# EAGLE design FM-1.2 (EAGLE 8.2.1)
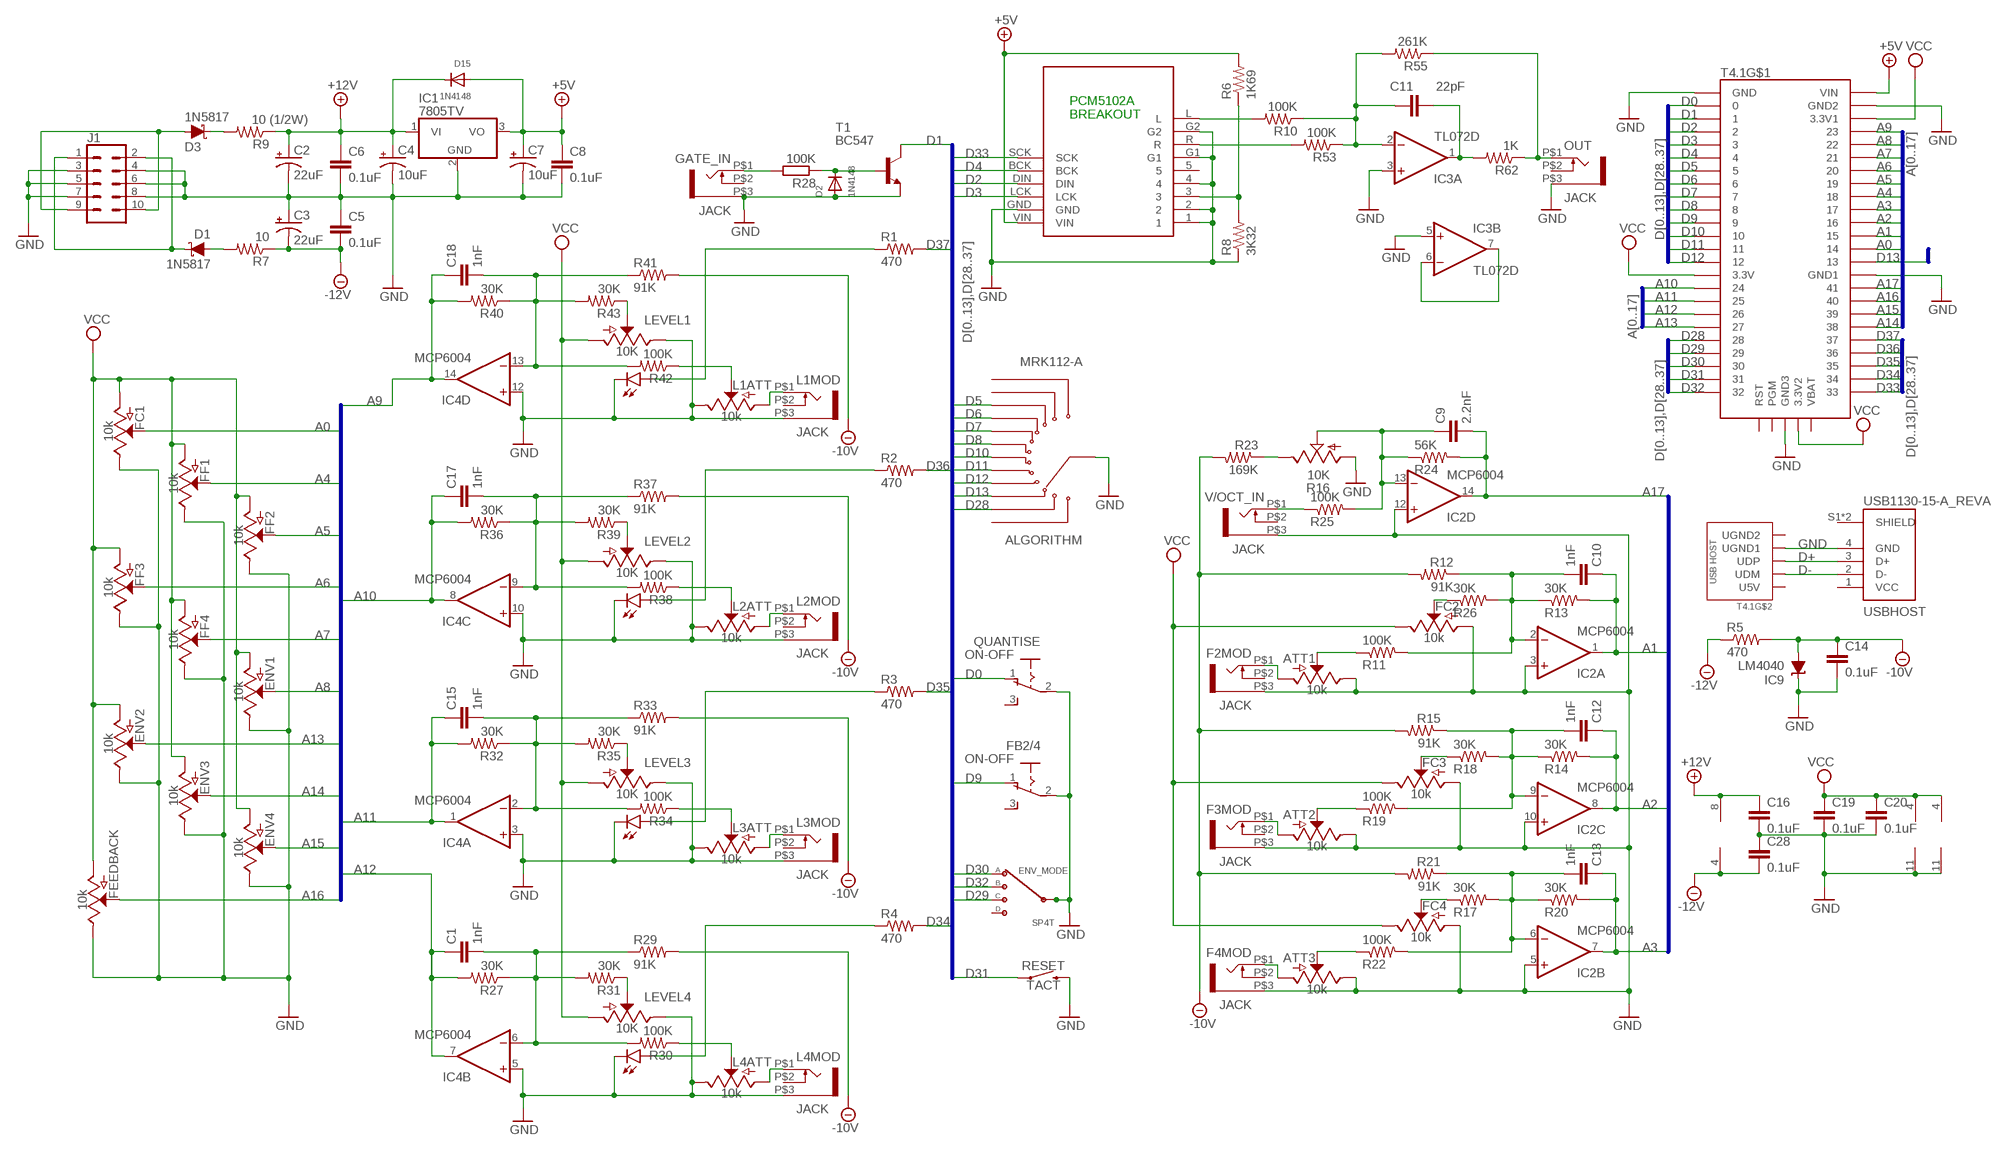
[diagram p0: schematic, sheet 1]

## Parts
ALGORITHM  MRK112-A  [SW_MRK112-A]
ATT1  10k  POTENTIOMETER-PTH-9MM-1/20W-20%  [POT-PTH-ALPS]
ATT2  10k  POTENTIOMETER-PTH-9MM-1/20W-20%  [POT-PTH-ALPS]
ATT3  10k  POTENTIOMETER-PTH-9MM-1/20W-20%  [POT-PTH-ALPS]
C1  1nF  C-EUC0603K  [C0603K]
C2  22uF  10UF-POLAR-RADIAL-2.5MM-25V-20%  [CPOL-RADIAL-2.5MM-5MM]
C3  22uF  10UF-POLAR-RADIAL-2.5MM-25V-20%  [CPOL-RADIAL-2.5MM-5MM]
C4  10uF  10UF-POLAR-RADIAL-2.5MM-25V-20%  [CPOL-RADIAL-2.5MM-5MM]
C5  0.1uF  C-EUC0603K  [C0603K]
C6  0.1uF  C-EUC0603K  [C0603K]
C7  10uF  10UF-POLAR-RADIAL-2.5MM-25V-20%  [CPOL-RADIAL-2.5MM-5MM]
C8  0.1uF  C-EUC0603K  [C0603K]
C9  2.2nF  C-EUC0603K  [C0603K]
C10  1nF  C-EUC0603K  [C0603K]
C11  22pF  C-EUC0603K  [C0603K]
C12  1nF  C-EUC0603K  [C0603K]
C13  1nF  C-EUC0603K  [C0603K]
C14  0.1uF  C-EUC0603K  [C0603K]
C15  1nF  C-EUC0603K  [C0603K]
C16  0.1uF  C-EUC0603K  [C0603K]
C17  1nF  C-EUC0603K  [C0603K]
C18  1nF  C-EUC0603K  [C0603K]
C19  0.1uF  C-EUC0603K  [C0603K]
C20  0.1uF  C-EUC0603K  [C0603K]
C28  0.1uF  C-EUC0603K  [C0603K]
D1  1N5817  DIODE-SCHOTTKY-BAT60A  [SOD-323]
D2  1N4148  DIODESOD-123  [SOD-123]
D3  1N5817  DIODE-SCHOTTKY-BAT60A  [SOD-323]
D15  1N4148  DIODESOD-123  [SOD-123]
ENV1  10k  POTENTIOMETER-PTH-9MM-1/20W-20%  [POT-PTH-ALPS]
ENV2  10k  POTENTIOMETER-PTH-9MM-1/20W-20%  [POT-PTH-ALPS]
ENV3  10k  POTENTIOMETER-PTH-9MM-1/20W-20%  [POT-PTH-ALPS]
ENV4  10k  POTENTIOMETER-PTH-9MM-1/20W-20%  [POT-PTH-ALPS]
ENV_MODE  SP4T  [SP4T]
F2MOD  JACK  WQP-PJ301M-12_JACK  [WQP-PJ301M-12_JACK]
F3MOD  JACK  WQP-PJ301M-12_JACK  [WQP-PJ301M-12_JACK]
F4MOD  JACK  WQP-PJ301M-12_JACK  [WQP-PJ301M-12_JACK]
FB2/4  ON-OFF  255SB  [255SB]
FC1  10k  POTENTIOMETER-PTH-9MM-1/20W-20%  [POT-PTH-ALPS]
FC2  10k  POTENTIOMETER-PTH-9MM-1/20W-20%  [POT-PTH-ALPS]
FC3  10k  POTENTIOMETER-PTH-9MM-1/20W-20%  [POT-PTH-ALPS]
FC4  10k  POTENTIOMETER-PTH-9MM-1/20W-20%  [POT-PTH-ALPS]
FEEDBACK  10k  POTENTIOMETER-PTH-9MM-1/20W-20%  [POT-PTH-ALPS]
FF1  10k  POTENTIOMETER-PTH-9MM-1/20W-20%  [POT-PTH-ALPS]
FF2  10k  POTENTIOMETER-PTH-9MM-1/20W-20%  [POT-PTH-ALPS]
FF3  10k  POTENTIOMETER-PTH-9MM-1/20W-20%  [POT-PTH-ALPS]
FF4  10k  POTENTIOMETER-PTH-9MM-1/20W-20%  [POT-PTH-ALPS]
GATE_IN  JACK  WQP-PJ301M-12_JACK  [WQP-PJ301M-12_JACK]
IC1  7805TV  [TO220V]
IC2  MCP6004  4AMP_P4+11D  [SO14]
IC3  TL072D  [SO08]
IC4  MCP6004  4AMP_P4+11D  [SO14]
IC9  LM4040  LM4041A12LP  [LP_O-PBCY-W3]
J1  CONN_05X2SHD  [2X5-SHROUDED]
L1ATT  10k  POTENTIOMETER-PTH-9MM-1/20W-20%  [POT-PTH-ALPS]
L1MOD  JACK  WQP-PJ301M-12_JACK  [WQP-PJ301M-12_JACK]
L2ATT  10k  POTENTIOMETER-PTH-9MM-1/20W-20%  [POT-PTH-ALPS]
L2MOD  JACK  WQP-PJ301M-12_JACK  [WQP-PJ301M-12_JACK]
L3ATT  10k  POTENTIOMETER-PTH-9MM-1/20W-20%  [POT-PTH-ALPS]
L3MOD  JACK  WQP-PJ301M-12_JACK  [WQP-PJ301M-12_JACK]
L4ATT  10k  POTENTIOMETER-PTH-9MM-1/20W-20%  [POT-PTH-ALPS]
L4MOD  JACK  WQP-PJ301M-12_JACK  [WQP-PJ301M-12_JACK]
LEVEL1  10K  POTENTIOMETER_SLIDE_LEDMEDIUM  [SLIDER-MEDIUM-LED]
LEVEL2  10K  POTENTIOMETER_SLIDE_LEDMEDIUM  [SLIDER-MEDIUM-LED]
LEVEL3  10K  POTENTIOMETER_SLIDE_LEDMEDIUM  [SLIDER-MEDIUM-LED]
LEVEL4  10K  POTENTIOMETER_SLIDE_LEDMEDIUM  [SLIDER-MEDIUM-LED]
OUT  JACK  WQP-PJ301M-12_JACK  [WQP-PJ301M-12_JACK]
QUANTISE  ON-OFF  255SB  [255SB]
R1  470  R-US_R0603  [R0603]
R2  470  R-US_R0603  [R0603]
R3  470  R-US_R0603  [R0603]
R4  470  R-US_R0603  [R0603]
R5  470  R-US_R0603  [R0603]
R6  1K69  R-US_R0603  [R0603]
R7  10  R-US_R0603  [R0603]
R8  3K32  R-US_R0603  [R0603]
R9  10 (1/2W)  R-US_0207/10  [0207/10]
R10  100K  R-US_R0603  [R0603]
R11  100K  R-US_R0603  [R0603]
R12  91K  R-US_R0603  [R0603]
R13  30K  R-US_R0603  [R0603]
R14  30K  R-US_R0603  [R0603]
R15  91K  R-US_R0603  [R0603]
R16  10K  TRIM_US-B25P  [B25P]
R17  30K  R-US_R0603  [R0603]
R18  30K  R-US_R0603  [R0603]
R19  100K  R-US_R0603  [R0603]
R20  30K  R-US_R0603  [R0603]
R21  91K  R-US_R0603  [R0603]
R22  100K  R-US_R0603  [R0603]
R23  169K  R-US_R0603  [R0603]
R24  56K  R-US_R0603  [R0603]
R25  100K  R-US_R0603  [R0603]
R26  30K  R-US_R0603  [R0603]
R27  30K  R-US_R0603  [R0603]
R28  100K  R-EU_R0603  [R0603]
R29  91K  R-US_R0603  [R0603]
R30  100K  R-US_R0603  [R0603]
R31  30K  R-US_R0603  [R0603]
R32  30K  R-US_R0603  [R0603]
R33  91K  R-US_R0603  [R0603]
R34  100K  R-US_R0603  [R0603]
R35  30K  R-US_R0603  [R0603]
R36  30K  R-US_R0603  [R0603]
R37  91K  R-US_R0603  [R0603]
R38  100K  R-US_R0603  [R0603]
R39  30K  R-US_R0603  [R0603]
R40  30K  R-US_R0603  [R0603]
R41  91K  R-US_R0603  [R0603]
R42  100K  R-US_R0603  [R0603]
R43  30K  R-US_R0603  [R0603]
R53  100K  R-US_R0603  [R0603]
R55  261K  R-US_R0603  [R0603]
R62  1K  R-US_R0603  [R0603]
RESET  TACT  MOMENTARY-SWITCH-SPST-PTH-6.0MM  [TACTILE_SWITCH_PTH_6.0MM]
T1  BC547  [TO92]
T4.1  TEENSY4.1  [TEENSY4.1]
U$2  PCM5102A BREAKOUT  I2S_PCM_51XX_SOUNDCARD  [I2S_PCM_5100_SOUNDCARD]
USBHOST  USB1130-15-A_REVA  [GCT_USB1130-15-A_REVA]
V/OCT_IN  JACK  WQP-PJ301M-12_JACK  [WQP-PJ301M-12_JACK]

## Nets
+5V: C7.1(+) C8.1 D15.A IC1.3(VO) R6.2 T4.1.VIN U$2.VIN
+12V: C2.1(+) C4.1(+) C6.1 C16.1 D15.C IC1.1(VI) IC3.8(P:V+) R9.1
-10V: C14.1 IC9.3(A) R5.2 R12.2 R15.2 R21.2 R23.2 R29.2 R33.2 R37.2 R41.2
-12V: C3.2(-) C5.2 C28.2 IC3.4(P:V-) R5.1 R7.1
A0: FC1.P$2(S) T4.1.14/A0
A1: C10.1 IC2.1(A:OUT) R13.2 T4.1.15/A1
A2: C12.1 IC2.8(C:OUT) R14.2 T4.1.16/A2
A3: C13.1 IC2.7(B:OUT) R20.2 T4.1.17/A3
A4: FF1.P$2(S) T4.1.18/A4/SDA
A5: FF2.P$2(S) T4.1.19/A5/SCL
A6: FF3.P$2(S) T4.1.20/A6
A7: FF4.P$2(S) T4.1.21/A7
A8: ENV1.P$2(S) T4.1.22/A8
A9: C18.1 IC4.14(D:OUT) R40.2 T4.1.23/A9
A10: C17.1 IC4.8(C:OUT) R36.2 T4.1.24
A11: C15.1 IC4.1(A:OUT) R32.2 T4.1.25
A12: C1.1 IC4.7(B:OUT) R27.2 T4.1.26
A13: ENV2.P$2(S) T4.1.27
A14: ENV3.P$2(S) T4.1.38
A15: ENV4.P$2(S) T4.1.39
A16: FEEDBACK.P$2(S) T4.1.40
A17: C9.2 IC2.14(D:OUT) R24.2 T4.1.41
D0: QUANTISE.1(O) T4.1.0/RX
D1: T1.3(C) T4.1.1/TX
D2: T4.1.2 U$2.DIN
D3: T4.1.3 U$2.LCK
D4: T4.1.4 U$2.BCK
D5: ALGORITHM.10 T4.1.5
D6: ALGORITHM.9 T4.1.6
D7: ALGORITHM.8 T4.1.7
D8: ALGORITHM.7 T4.1.8
D9: FB2/4.1(O) T4.1.9
D10: ALGORITHM.6 T4.1.10/CS
D11: ALGORITHM.5 T4.1.11/MOSI
D12: ALGORITHM.4 T4.1.12/MISO
D13: ALGORITHM.3 T4.1.13/SCK
D28: ALGORITHM.2 T4.1.28
D29: ENV_MODE.4(C) T4.1.29
D30: ENV_MODE.2(A) T4.1.30
D31: RESET.1 T4.1.31/A12
D32: ENV_MODE.3(B) T4.1.32
D33: T4.1.33 U$2.SCK
D34: R4.2 T4.1.34
D35: R3.2 T4.1.35
D36: R2.2 T4.1.36
D37: R1.2 T4.1.37
D+: T4.1.UD+(UDP) USBHOST.3(D+)
D-: T4.1.UD-(UDM) USBHOST.2(D-)
GND: ALGORITHM.A ATT1.P$1(E) ATT2.P$1(E) ATT3.P$1(E) C2.2(-) C3.1(+) C4.2(-) C5.1 C6.2 C7.2(-) C8.2 C14.2 C16.2 C19.2 C20.2 C28.1 D2.A ENV1.P$1(E) ENV2.P$1(E) ENV3.P$1(E) ENV4.P$1(E) ENV_MODE.1(INPUT) ENV_MODE.6 F2MOD.P$3 F3MOD.P$3 F4MOD.P$3 FB2/4.2(P) FC1.P$1(E) FC2.P$3(A) FC3.P$3(A) FC4.P$3(A) FEEDBACK.P$1(E) FF1.P$1(E) FF2.P$1(E) FF3.P$1(E) FF4.P$1(E) GATE_IN.P$3 IC1.2(GND) IC2.3(A:+IN) IC2.5(B:+IN) IC2.10(C:+IN) IC2.11(P:V-) IC2.12(D:+IN) IC3.3(A:+IN) IC3.5(B:+IN) IC4.3(A:+IN) IC4.5(B:+IN) IC4.10(C:+IN) IC4.11(P:V-) IC4.12(D:+IN) IC9.2(C) J1.3 J1.4 J1.5 J1.6 J1.7 J1.8 L1ATT.P$1(E) L1MOD.P$3 L2ATT.P$1(E) L2MOD.P$3 L3ATT.P$1(E) L3MOD.P$3 L4ATT.P$1(E) L4MOD.P$3 LEVEL1.P$3 LEVEL1.P$E(E) LEVEL2.P$3 LEVEL2.P$E(E) LEVEL3.P$3 LEVEL3.P$E(E) LEVEL4.P$3 LEVEL4.P$E(E) OUT.P$3 QUANTISE.2(P) R8.1 R16.A RESET.3 T1.1(E) T4.1.AGND(GND2) T4.1.GND T4.1.GND1 T4.1.GND2(GND3) T4.1.GND-U1(UGND1) U$2.1 U$2.2 U$2.4 U$2.G1 U$2.G2 U$2.GND USBHOST.4(GND) V/OCT_IN.P$3
N$1: C11.2 IC3.1(A:OUT) R62.2
N$2: LEVEL3.P$B(B) R3.1
N$3: C15.2 IC4.2(A:-IN) R32.1 R33.1 R34.2 R35.2
N$4: D1.C J1.1 J1.2
N$5: R25.1 V/OCT_IN.P$1
N$6: D3.A J1.9 J1.10
N$7: D3.C R9.2
N$8: LEVEL3.P$2 R35.1
N$9: D1.A R7.2
N$10: LEVEL4.P$B(B) R4.1
N$11: R10.2 U$2.L
N$12: R6.1 R8.2 U$2.3
N$13: R53.2 U$2.R
N$14: ATT2.P$3(A) F3MOD.P$1
N$15: FC2.P$2(S) R26.1
N$16: C10.2 IC2.2(A:-IN) R11.2 R12.1 R13.1 R26.2
N$17: C12.2 IC2.9(C:-IN) R14.1 R15.1 R18.2 R19.2
N$18: ATT1.P$2(S) R11.1
N$19: C13.2 IC2.6(B:-IN) R17.2 R20.1 R21.1 R22.2
N$20: ATT2.P$2(S) R19.1
N$21: C9.1 IC2.13(D:-IN) R16.S R24.1 R25.2
N$22: FC4.P$2(S) R17.1
N$23: ATT3.P$3(A) F4MOD.P$1
N$24: FC3.P$2(S) R18.1
N$25: R16.E R23.1
N$26: IC3.6(B:-IN) IC3.7(B:OUT)
N$27: ATT3.P$2(S) R22.1
N$28: ATT1.P$3(A) F2MOD.P$1
N$29: GATE_IN.P$1 R28.2
N$30: D2.C R28.1 T1.2(B)
N$31: C1.2 IC4.6(B:-IN) R27.1 R29.1 R30.2 R31.2
N$32: LEVEL4.P$2 R31.1
N$33: L4ATT.P$3(A) L4MOD.P$1
N$34: L4ATT.P$2(S) R30.1
N$36: L3ATT.P$3(A) L3MOD.P$1
N$37: L3ATT.P$2(S) R34.1
N$39: LEVEL2.P$B(B) R2.1
N$40: C17.2 IC4.9(C:-IN) R36.1 R37.1 R38.2 R39.2
N$41: LEVEL2.P$2 R39.1
N$42: L2ATT.P$3(A) L2MOD.P$1
N$43: L2ATT.P$2(S) R38.1
N$45: LEVEL1.P$B(B) R1.1
N$46: C18.2 IC4.13(D:-IN) R40.1 R41.1 R42.2 R43.2
N$47: LEVEL1.P$2 R43.1
N$48: L1ATT.P$3(A) L1MOD.P$1
N$49: L1ATT.P$2(S) R42.1
N$53: C11.1 IC3.2(A:-IN) R10.1 R53.1 R55.2
N$55: OUT.P$1 R55.1 R62.1
VCC: C19.1 C20.1 ENV1.P$3(A) ENV2.P$3(A) ENV3.P$3(A) ENV4.P$3(A) FC1.P$3(A) FC2.P$1(E) FC3.P$1(E) FC4.P$1(E) FEEDBACK.P$3(A) FF1.P$3(A) FF2.P$3(A) FF3.P$3(A) FF4.P$3(A) IC2.4(P:V+) IC4.4(P:V+) LEVEL1.P$1 LEVEL2.P$1 LEVEL3.P$1 LEVEL4.P$1 T4.1.3V3(3.3V) T4.1.3V3_LO(3.3V1) T4.1.V33(3.3V2)
Unconnected: ALGORITHM.1 ALGORITHM.11 ALGORITHM.12 ENV_MODE.5(D) F2MOD.P$2 F3MOD.P$2 F4MOD.P$2 FB2/4.3(S) GATE_IN.P$2 L1MOD.P$2 L2MOD.P$2 L3MOD.P$2 L4MOD.P$2 OUT.P$2 QUANTISE.3(S) T4.1.ELED T4.1.ER+ T4.1.ER- T4.1.ET+(ET-) T4.1.ET-(ET+) T4.1.GND-E(EGND) T4.1.GND-U2(UGND2) T4.1.PROG(PGM) T4.1.RST T4.1.UVHST(U5V) T4.1.VBAT U$2.5 USBHOST.S1(SHIELD) USBHOST.S2(SHIELD) V/OCT_IN.P$2

## Buses
A[0..17]
D[0..13],D[28..37]

## Notes on the sheet
- PCM5102A
  BREAKOUT

## Power pins joined to a net without a drawn wire
VCC: USBHOST.1(VCC)

## Library data of the parts
ALGORITHM = MRK112-A:MRK112-A: Check availability <https://pricing.snapeda.com/parts/MRK112-A/NKK%20Switches/view-part?ref=eda>; AVAILABILITY: In Stock; DESCRIPTION: Rotary Switch 2 ~ 12 Position SP12T 0.4VA (AC/DC) 28 VAC Panel Mount, Through Hole; MF: NKK Switches; MP: MRK112-A; PACKAGE: None; PRICE: None; PURCHASE-URL: https://pricing.snapeda.com/search/part/MRK112-A/?ref=eda
ATT1-ATT3 ENV1-ENV4 FC1-FC4 FEEDBACK FF1-FF4 L1ATT L2ATT L3ATT L4ATT = SparkFun-Resistors:POTENTIOMETER: Potentiometer (Pot) Three-terminal potentiometers, with an adjustable wiper and two adjustable resistors. A pot can be used to create a configurable voltage divider, or as a variable resistor. Variants ALPS_POT and ALPS_POT_KIT - PTH, breadboard compatible, 9mm square pots Rotary Potentiometer - Linear (10k ohm) <https://www.sparkfun.com/products/9288> (COM-09288) The KIT variant exposes copper on only one side of the PTH pad, so the part can only be assembled on one side of the PCB. Useful for beginner soldering kits.; PROD_ID: RES-09177; SF_SKU: COM-09288
C1 C5 C6 C8-C20 C28 = rcl:C-EU: CAPACITOR, European symbol
C2 C3 = SparkFun-Capacitors:10UF-POLAR: 10.0µF polarized capacitors A capacitor is a passive two-terminal electrical component used to store electrical energy temporarily in an electric field.; PROD_ID: CAP-08440; VALUE: 10uF
C4 C7 = SparkFun-Capacitors:10UF-POLAR: 10.0µF polarized capacitors A capacitor is a passive two-terminal electrical component used to store electrical energy temporarily in an electric field.; PROD_ID: CAP-08440
D1 D3 = SparkFun-DiscreteSemi:DIODE-SCHOTTKY: Schottky diode A Schottky diode is a semiconductor diode which has a low forward voltage drop and a very fast switching action.; PROD_ID: DIO-14072; VALUE: 3A/10V/280mV
D2 D15 = adafruit:DIODE: Diode SMADIODE - SMA Surface Mount Package 20V 1A Schottky Diode Digikey: 641-1014-6-ND DO-1N4148 - Through Hole Small Current Diode SOD-123 20V 1 A (.5mV Vf) Schottky Diode - Digikey: MBRX120TPMSCT-ND SOD-323 10V 570mA (.38mV Vf, 3ns) Schottky Diode - Digikey: ZLLS410CT-ND SOD-523 30V 30mA Schottky Diode (RB751S-40TE61) - Digikey: RB751S-40TE61CT-ND SOT23-R/W - SOT23 Package (R = Solder Paste/Reflow Ovens, W = Hand-Soldering) BAT54Film 40V 300mA - Digikey: 497-7162-1-ND
ENV_MODE = switches-2:SP4T
F2MOD F3MOD F4MOD GATE_IN L1MOD L2MOD L3MOD L4MOD OUT V/OCT_IN = thonkiconn:WQP-PJ301M-12_JACK
FB2/4 QUANTISE = customswitch:255SB: SLIDING SWITCH Distributor Buerklin, 11G810
IC1 = linear:78*: Positive VOLTAGE REGULATOR Source: http://cache.national.com/ds/LM/LM78L05.pdf http://www.fairchildsemi.com/ds/LM/LM7805.pdf
IC2 IC4 = linear:4AMP_P4+11: OP AMP
IC3 = linear:TL072: OP AMP
IC9 = texas:LM4041: PRECISION MICROPOWER SHUNT VOLTAGE REFERENCE Source: http://focus.ti.com/lit/ds/slcs146e/slcs146e.pdf; OC_FARNELL: 9486119; OC_NEWARK: unknown
J1 = SparkFun-Connectors:CONN_05X2: Multi connection point. Often used as Generic Header-pin footprint for 0.1 inch spaced/style header connections For AVR SPI programming port, see special device with nice symbol: "AVR_SPI_PROG_5x2.dev" You can populate with any combo of single row headers, but if you'd like an exact match, check these: 2x5 AVR ICSP Male Header <https://www.sparkfun.com/products/778> (PRT-00778) 2x5 Pin Shrouded Header <https://www.sparkfun.com/products/8506> (PRT-08506) On any of the 0.1 inch spaced packages, you can populate with these: Break Away Headers - Straight <https://www.sparkfun.com/products/116> (PRT-00116) Break Away Male Headers - Right Angle <https://www.sparkfun.com/products/553> (PRT-00553) Female Headers <https://www.sparkfun.com/products/115> (PRT-00115) Break Away Headers - Machine Pin <https://www.sparkfun.com/products/117> (PRT-00117) Break Away Female Headers - Swiss Machine Pin <https://www.sparkfun.com/products/743> (PRT-00743) Special note: the shrouded connector mates well with our 5x2 ribbon cables: 2x5 Pin IDC Ribbon Cable <https://www.sparkfun.com/products/8535> (PRT-08535); PROD_ID: CONN-08671; SF_ID: PRT-08506
LEVEL1-LEVEL4 = SparkFun-Resistors:POTENTIOMETER_SLIDE_LED: Slide Potentiometer Slide-type potentiometers - pots that are adjusted by sliding a wiper up or down. Commonly found en-masse on sound boards. Variants 60MM - Slide Pot - X-Large (10k Linear Taper) <https://www.sparkfun.com/products/9119> (COM-09119) 10k linear slide pot with 60mm travel. Datasheet <http://cdn.sparkfun.com/datasheets/Components/Switches/SC608N-b10k.pdf> 30MM, 30MM-KIT - Slide Pot - Medium (10k Linear Taper) <https://www.sparkfun.com/products/11621> (COM-11621) 10k linear slide pot with 30mm travel. Datasheet <http://cdn.sparkfun.com/datasheets/Components/Switches/C-31-.pdf> (C3031N-1A2-B10K-GP) "KIT" variant, intended for soldering kits, has tStop removed from pads so the component can only be stuffed on one side of the board. 20MM - Slide Pot - Small (10k Linear Taper) <https://www.sparkfun.com/products/11620> (COM-11620) 10k linear slide pot with 20mm travel. Datasheet <http://cdn.sparkfun.com/datasheets/Components/Switches/C-31-.pdf> (C2031N-1A2-B10K-GP)
R1-R15 R17-R27 R29-R43 R53 R55 R62 = rcl:R-US_: RESISTOR, American symbol
R16 = pot:TRIM_US-: POTENTIOMETER
R28 = resistor:R-EU_: RESISTOR, European symbol
RESET = SparkFun-Switches:MOMENTARY-SWITCH-SPST: Momentary Switch (Pushbutton) - SPST Normally-open (NO) SPST momentary switches (buttons, pushbuttons). Variants PTH-12MM - 12mm square, through-hole Momentary Pushbutton Switch - 12mm Square <https://www.sparkfun.com/products/9190> (COM-09190) PTH-6.0MM, PTH-6.0MM-KIT - 6.0mm square, through-hole Mini Pushbutton Switch <https://www.sparkfun.com/products/97> (COM-00097) KIT package intended for soldering kit's - only one side of pads' copper is exposed. PTH-RIGHT-ANGLE-KIT - Right-angle, through-hole Right Angle Tactile Button <https://www.sparkfun.com/products/10791> - Used on SparkFun BigTime Watch Kit <https://www.sparkfun.com/products/11734> SMD-12MM - 12mm square, surface-mount Tactile Button - SMD (12mm) <https://www.sparkfun.com/products/12993> (COM-12993) Used on SparkFun PicoBoard <https://www.sparkfun.com/products/11888> SMD-4.5MM - 4.5mm Square Trackball Switch Used on SparkFun Blackberry Trackballer Breakout <https://www.sparkfun.com/products/13169> SMD-4.6MMX2.8MM - 4.60mm x 2.80mm, surface mount Used on SparkFun Pro Micro - RP2040 <https://www.sparkfun.com/products/17717> SMD-5.2MM, SMD-5.2-REDUNDANT - 5.2mm square, surface-mount Mini Pushbutton Switch - SMD <https://www.sparkfun.com/products/8720> (COM-08720) Used on Arduino Pro Mini <https://www.sparkfun.com/products/11114> REDUNDANT package connects both switch circuits together SMD-6.0X3.5MM - 6.0 x 3.5mm, surface mount Momentary Reset Switch SMD <https://www.sparkfun.com/products/8229> (COM-08229) SMD-6.2MM-TALL - 6.2mm square, surface mount Tactile Button - SMD (6mm) <https://www.sparkfun.com/products/12992> Used on SparkFun Digital Sandbox <https://www.sparkfun.com/products/12651> SMD-RIGHT-ANGLE - Right-angle, surface mount Used on SparkFun Block for Intel® Edison - Arduino <https://www.sparkfun.com/products/13036>; PROD_ID: SWCH-08441; SF_SKU: COM-00097
T1 = transistor:BC547: NPN TRANSISTOR
T4.1 = teensy4.1.dist:TEENSY4.1
U$2 = PCM5102A:I2S_PCM_51XX_SOUNDCARD
USBHOST = USB1130-15-A_REVA:USB1130-15-A_REVA: Check availability <https://pricing.snapeda.com/parts/USB1130-15-A/Global%20Connector%20Technology/view-part?ref=eda>; AVAILABILITY: In Stock; DESCRIPTION: USB 2.0 Connector Full size Horizontal Plug, type A, 4 Pins, Through hole, Top mount, 6.99mm profile, High mating cycle, charging receptacle; MF: Global Connector Technology; MP: USB1130-15-A; PACKAGE: None; PRICE: None; PURCHASE-URL: https://pricing.snapeda.com/search/part/USB1130-15-A/?ref=eda

## Board
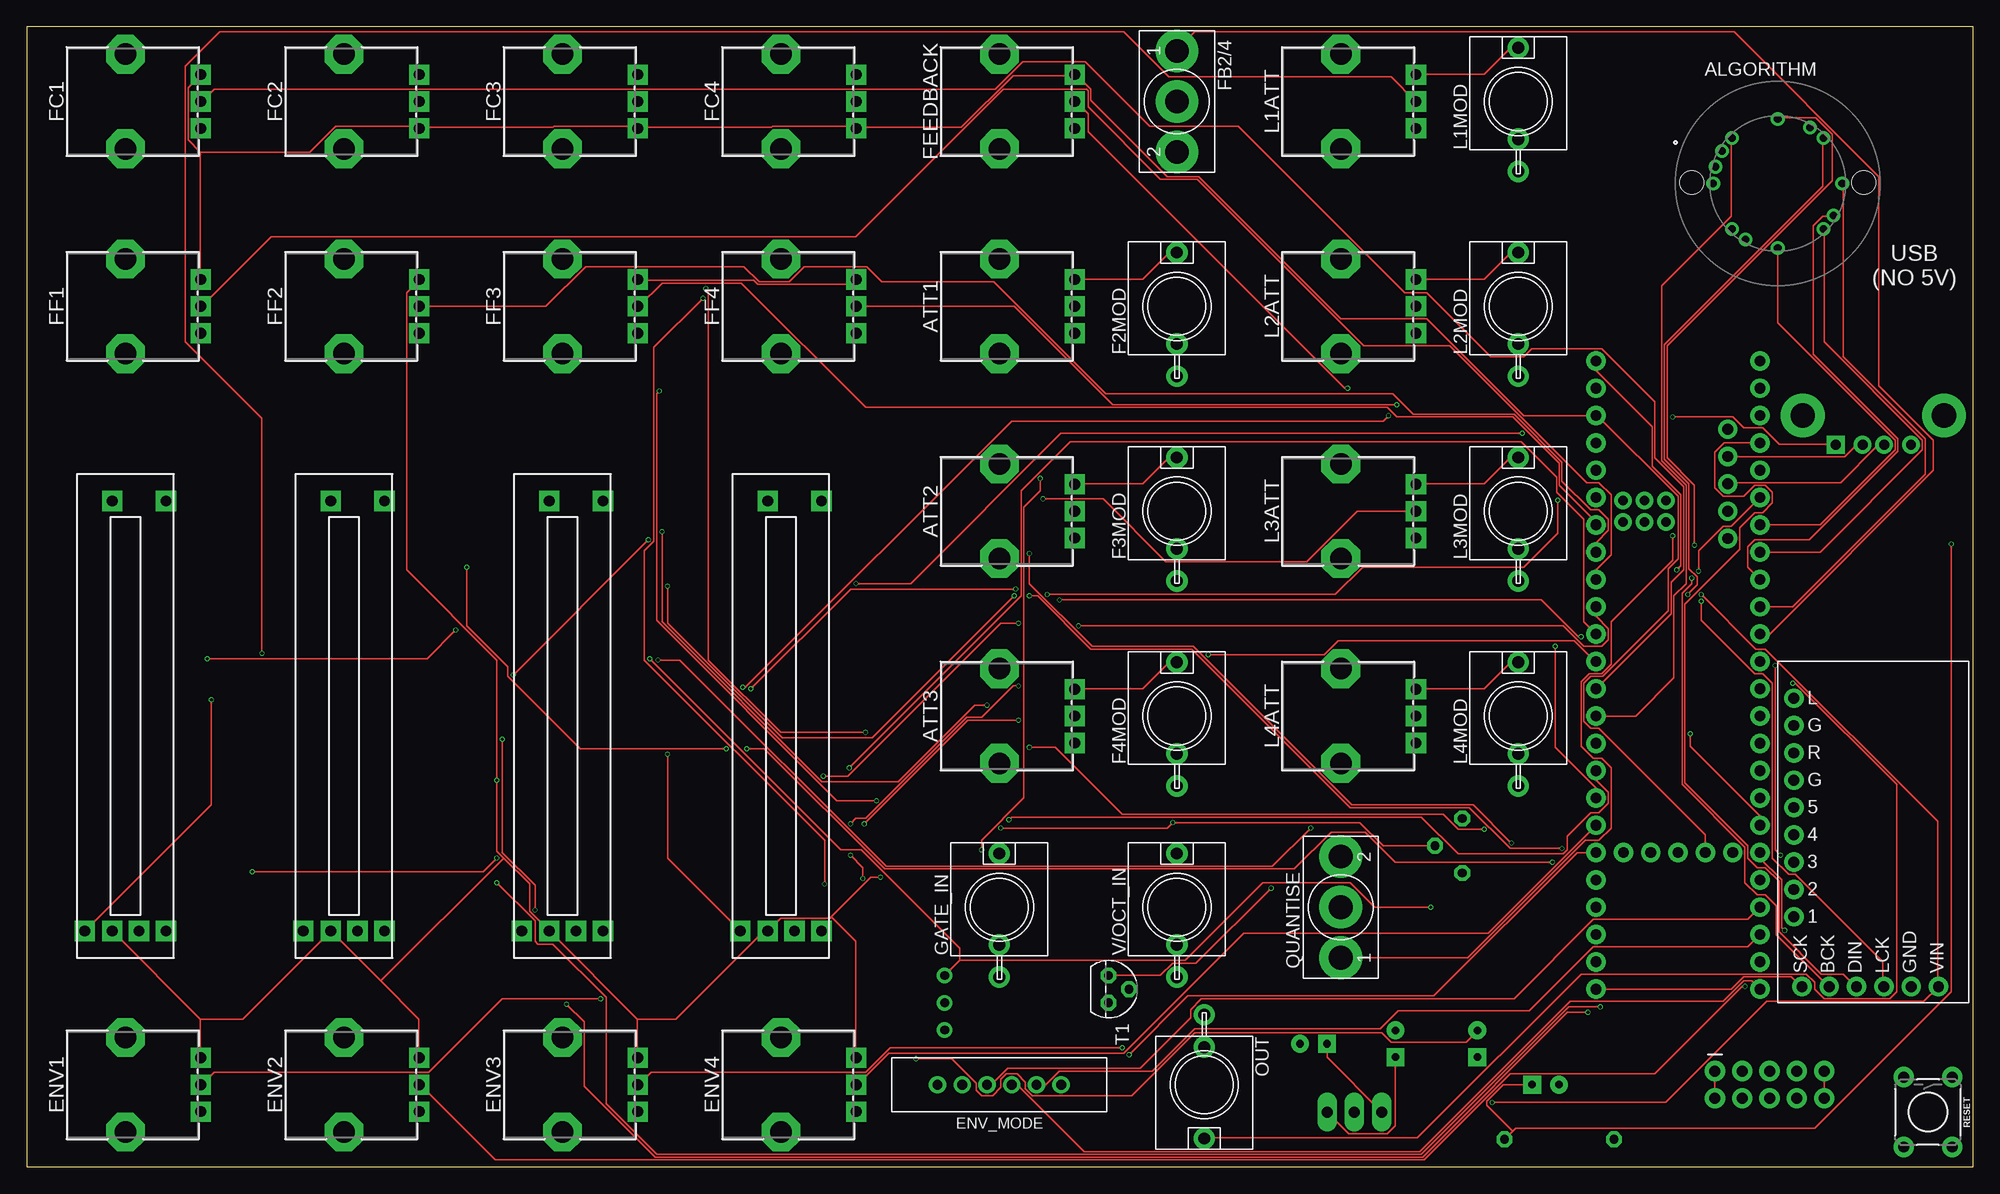
[diagram p1: board, top side]
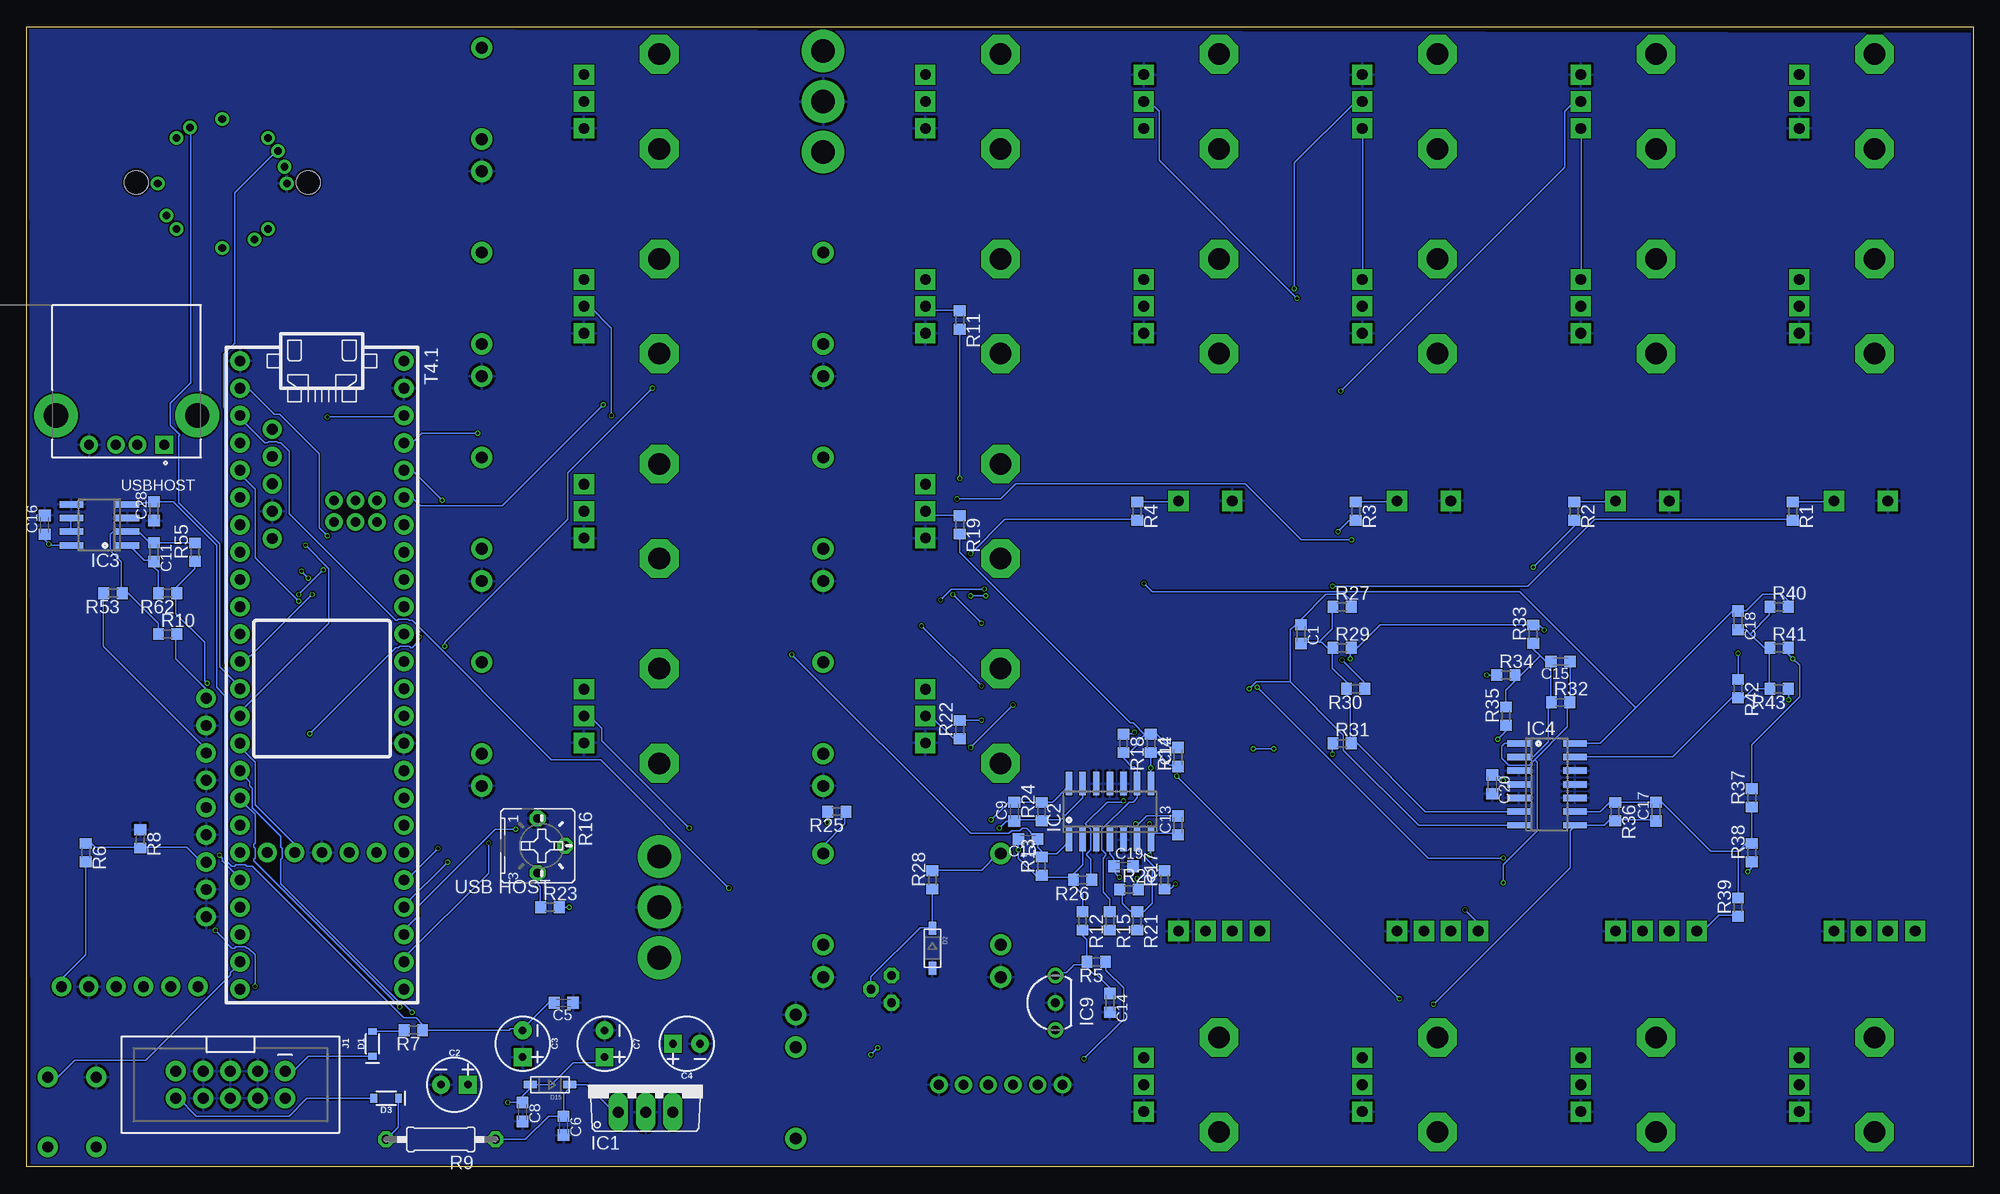
[diagram p2: board, bottom side, seen from below]

Size 181 x 106 mm. Coordinates in mm from the lower left corner, seen from the top.
Outline: 0,0 181,0 181,106 0,106 0,0
Copper layers (1*16): Top 0.035mm / dielectric 1.6mm / Bottom 0.035mm
Design rules "jlcpcb-2layers": minimum track width 5mil, minimum drill 0.3mm, track to track 5mil, track to pad 5mil, pad to pad 5mil, via to via 5mil, smd to smd 5mil, copper to edge 0.2mm, drill to drill 6mil, minimum pad ring 10mil, minimum via ring 3mil, stop-mask expansion 4mil, vias tented up to drill 0mil, thermal gap 10mil
Holes 2.2 mm at 154.83,91.53 170.83,91.53

### Footprints (pad centres in the part's own frame; a part is rotated, then mirrored left to right if it is on the bottom)
SW_MRK112-A = drill 0.7 pad 1: 1 -1.553,-5.796; 2 -3,-5.196; 3 -4.243,-4.243; 4 -6,0; 5 -5.196,3; 6 -4.243,4.243; 7 0,6; 8 3,5.196; 9 4.243,4.243; 10 6,0; 11 5.196,-3; 12 4.243,-4.243; A 0,-6
POT-PTH-ALPS = drill 1 pad 1.88 square: P$1 7,-2.5; P$2 7,0; P$3 7,2.5 | drill 2 octagon: P$4 0,-4.4; P$5 0,4.4
C0603K = smd 1.05 x 1.08: 1 -0.875,0; 2 0.875,0
CPOL-RADIAL-2.5MM-5MM = drill 0.7 pad 1.651 square: 1 1.25,0 | drill 0.7 pad 1.651: 2 -1.25,0
SOD-323 = smd 0.63 x 0.83: A 1.15,0; C -1.15,0
SOD-123 = smd 1.2 x 0.7: A 1.85,0; C -1.85,0
SP4T = drill 0.9: 1 -5.75,0; 2 -3.45,0; 3 -1.15,0; 4 1.15,0; 5 3.45,0; 6 5.75,0
WQP-PJ301M-12_JACK = drill 1.1: P$1 0,5; P$2 0,-3.5; P$3 0,-6.5
255SB = drill 2.2: 1 -4.7,0; 2 0,0; 3 4.7,0
TO220V = drill 1.016 long: 1 -2.54,-2.54; 2 0,-2.54; 3 2.54,-2.54
SO14 = smd 0.6 x 2.2: 1 -3.81,-2.6; 2 -2.54,-2.6; 3 -1.27,-2.6; 4 0,-2.6; 5 1.27,-2.6; 6 2.54,-2.6; 7 3.81,-2.6; 8 3.81,2.6; 9 2.54,2.6; 10 1.27,2.6; 11 0,2.6; 12 -1.27,2.6; 13 -2.54,2.6; 14 -3.81,2.6
SO08 = smd 0.6 x 2.2: 1 -1.905,-2.6; 2 -0.635,-2.6; 3 0.635,-2.6; 4 1.905,-2.6; 5 1.905,2.6; 6 0.635,2.6; 7 -0.635,2.6; 8 -1.905,2.6
LP_O-PBCY-W3 = drill 0.8 pad 1.4: 1 -2.54,0; 2 0,0; 3 2.54,0
2X5-SHROUDED = drill 1.016 pad 1.88: 1 -1.27,5.08; 2 1.27,5.08; 3 -1.27,2.54; 4 1.27,2.54; 5 -1.27,0; 6 1.27,0; 7 -1.27,-2.54; 8 1.27,-2.54; 9 -1.27,-5.08; 10 1.27,-5.08
SLIDER-MEDIUM-LED = drill 1 pad 1.88 square: P$1 -20,1.23; P$2 -20,3.77; P$3 20,1.23; P$B 20,-3.77; P$E -20,-3.77; P$L -20,-1.27
R0603 = smd 1 x 1.1: 1 -0.85,0; 2 0.85,0
0207/10 = drill 0.813 octagon: 1 -5.08,0; 2 5.08,0
B25P = drill 0.813 octagon: A -2.54,0; E 2.54,0; S 0,2.54
TACTILE_SWITCH_PTH_6.0MM = drill 1.016 pad 1.88: 1 -3.251,2.261; 2 3.251,2.261; 3 -3.251,-2.261; 4 3.251,-2.261
TO92 = drill 0.813 octagon: 1 1.27,0; 2 0,1.905; 3 -1.27,0
TEENSY4.1 = drill 1: 0/RX -26.67,-7.62; 1/TX -24.13,-7.62; 2 -21.59,-7.62; 3 -19.05,-7.62; 3V3 6.35,-7.62; 3V3_LO -24.13,7.62; 4 -16.51,-7.62; 5 -13.97,-7.62; 6 -11.43,-7.62; 7 -8.89,-7.62; 8 -6.35,-7.62; 9 -3.81,-7.62; 10/CS -1.27,-7.62; 11/MOSI 1.27,-7.62; 12/MISO 3.81,-7.62; 13/SCK 3.81,7.62; 14/A0 1.27,7.62; 15/A1 -1.27,7.62; 16/A2 -3.81,7.62; 17/A3 -6.35,7.62; 18/A4/SDA -8.89,7.62; 19/A5/SCL -11.43,7.62; 20/A6 -13.97,7.62; 21/A7 -16.51,7.62; 22/A8 -19.05,7.62; 23/A9 -21.59,7.62; 24 8.89,-7.62; 25 11.43,-7.62; 26 13.97,-7.62; 27 16.51,-7.62; 28 19.05,-7.62; 29 21.59,-7.62; 30 24.13,-7.62; 31/A12 26.67,-7.62; 32 29.21,-7.62; 33 29.21,7.62; 34 26.67,7.62; 35 24.13,7.62; 36 21.59,7.62; 37 19.05,7.62; 38 16.51,7.62; 39 13.97,7.62; 40 11.43,7.62; 41 8.89,7.62; AGND -26.67,7.62; GND -29.21,-7.62; GND1 6.35,7.62; GND2 16.51,0; GND-U1 -15.24,-4.62; GND-U2 -12.7,-4.62; PROG 16.51,2.54; RST 16.51,5.08; UD+ -17.78,-4.62; UD- -20.32,-4.62; UVHST -22.86,-4.62; V33 16.51,-2.54; VBAT 16.51,-5.08; VIN -29.21,7.62 | drill 0.9: ELED -16.24,3.12; ER+ -16.24,5.12; ER- -14.24,5.12; ET+ -14.24,1.12; ET- -16.24,1.12; GND-E -14.24,3.12
I2S_PCM_5100_SOUNDCARD = drill 1 pad 1.676: 1 1.5,8; 2 1.5,10.54; 3 1.5,13.08; 4 1.5,15.62; 5 1.5,18.16; BCK 4.79,1.5; DIN 7.33,1.5; G1 1.5,20.7; G2 1.5,25.78; GND 12.41,1.5; L 1.5,28.32; LCK 9.87,1.5; R 1.5,23.24; SCK 2.25,1.5; VIN 14.95,1.5
GCT_USB1130-15-A_REVA = drill 0.92 square: 1 -3.5,2.71 | drill 0.92: 2 -1,2.71; 3 1,2.71; 4 3.5,2.71 | drill 2.26: S1 -6.57,0; S2 6.57,0

### Placement (x,y rotation side)
ALGORITHM  162.83,91.44 270 top
ATT1  90.44,80.01 0 top
ATT2  90.44,60.96 0 top
ATT3  90.44,41.91 0 top
C1  62.5,49.53 270 bottom
C2  141.24,7.62 0 bottom
C3  134.89,11.43 270 bottom
C4  119.65,11.43 180 bottom
C5  131.08,15.24 180 bottom
C6  131.08,3.81 270 bottom
C7  127.27,11.43 270 bottom
C8  134.89,5.08 270 bottom
C9  89.17,33.02 90 bottom
C10  87.9,30.48 180 bottom
C11  169.18,57.15 270 bottom
C12  73.93,38.1 90 bottom
C13  73.93,31.75 90 bottom
C14  80.28,15.24 270 bottom
C15  38.37,46.99 180 bottom
C16  179.34,59.69 90 bottom
C17  29.48,33.02 90 bottom
C18  21.86,50.8 270 bottom
C19  79.01,27.94 0 bottom
C20  44.72,35.56 270 bottom
C28  169.18,60.96 90 bottom
D1  148.86,11.43 90 bottom
D2  96.79,20.32 270 bottom
D3  147.59,6.35 180 bottom
D15  132.35,7.62 180 bottom
ENV1  9.16,7.62 0 top
ENV2  29.48,7.62 0 top
ENV3  49.8,7.62 0 top
ENV4  70.12,7.62 0 top
ENV_MODE  90.44,7.62 180 top
F2MOD  106.95,80.01 0 top
F3MOD  106.95,60.96 0 top
F4MOD  106.95,41.91 0 top
FB2/4  106.95,99.06 270 top
FC1  9.16,99.06 0 top
FC2  29.48,99.06 0 top
FC3  49.8,99.06 0 top
FC4  70.12,99.06 0 top
FEEDBACK  90.44,99.06 0 top
FF1  9.16,80.01 0 top
FF2  29.48,80.01 0 top
FF3  49.8,80.01 0 top
FF4  70.12,80.01 0 top
GATE_IN  90.44,24.13 0 top
IC1  123.46,7.62 0 bottom
IC2  80.28,33.02 0 bottom
IC3  174.26,59.69 90 bottom
IC4  39.64,35.56 270 bottom
IC9  85.36,15.24 90 bottom
J1  162.07,7.62 270 bottom
L1ATT  122.19,99.06 0 top
L1MOD  138.7,99.06 0 top
L2ATT  122.19,80.01 0 top
L2MOD  138.7,80.01 0 top
L3ATT  122.19,60.96 0 top
L3MOD  138.7,60.96 0 top
L4ATT  122.19,41.91 0 top
L4MOD  138.7,41.91 0 top
LEVEL1  9.16,41.91 90 top
LEVEL2  29.48,41.91 90 top
LEVEL3  49.8,41.91 90 top
LEVEL4  70.12,41.91 90 top
OUT  109.49,7.62 180 top
QUANTISE  122.19,24.13 90 top
R1  16.78,60.96 270 bottom
R2  37.1,60.96 270 bottom
R3  57.42,60.96 270 bottom
R4  77.74,60.96 270 bottom
R5  81.55,19.05 180 bottom
R6  175.53,29.21 270 bottom
R7  145.05,12.7 180 bottom
R8  170.45,30.48 270 bottom
R9  142.51,2.54 180 bottom
R10  167.91,49.53 0 bottom
R11  94.25,78.74 270 bottom
R12  82.82,22.86 270 bottom
R13  86.63,27.94 90 bottom
R14  76.47,39.37 270 bottom
R15  80.28,22.86 270 bottom
R16  133.49,29.84 270 bottom
R17  75.2,26.67 90 bottom
R18  79.01,39.37 270 bottom
R19  94.25,59.69 270 bottom
R20  78.5,25.78 0 bottom
R21  77.74,22.86 270 bottom
R22  94.25,40.64 90 bottom
R23  132.35,24.13 0 bottom
R24  86.63,33.02 90 bottom
R25  105.68,33.02 180 bottom
R26  82.82,26.67 180 bottom
R27  58.69,52.07 0 bottom
R28  96.79,26.67 90 bottom
R29  58.69,48.26 0 bottom
R30  57.42,44.45 180 bottom
R31  58.69,39.37 0 bottom
R32  38.37,43.18 0 bottom
R33  40.91,49.53 90 bottom
R34  43.45,45.72 0 bottom
R35  43.45,41.91 90 bottom
R36  33.29,33.02 270 bottom
R37  20.59,34.29 90 bottom
R38  20.59,29.21 90 bottom
R39  21.86,24.13 90 bottom
R40  18.05,52.07 0 bottom
R41  18.05,48.26 0 bottom
R42  21.86,44.45 270 bottom
R43  18.05,44.45 180 bottom
R53  172.99,53.34 180 bottom
R55  165.37,57.15 90 bottom
R62  167.91,53.34 180 bottom
RESET  176.8,5.08 270 top
T1  100.6,16.51 270 top
T4.1  153.56,45.72 270 bottom
U$2  162.83,15.24 0 top
USBHOST  171.72,69.85 180 bottom
V/OCT_IN  106.95,24.13 0 top

### Tracks (layer width: path | path; a pad name or v marks a point on that pad's centre or on a via)
+5V  (via drill 0.3)
  Top 0.127: IC1.3 122.95,3.05 126.51,3.05 127.27,3.81 C7.1 | T4.1.VIN 145.94,74.04 151.15,68.83 151.15,65.15 153.81,62.48 153.81,55.88 v153.43,55.5 | v155.72,53.21 160.8,48.13 161.69,48.13 177.69,32.13 177.69,16.76 U$2.VIN 177.69,16.64 176.42,15.37 161.81,15.37 152.42,5.97 v136.29,5.97
  Bottom 0.127: C8.1 134.89,6.6 134.25,7.24 134.25,7.62 D15.A 132.22,7.62 130.19,9.65 127.78,9.65 127.27,10.16 C7.1 | R6.2 175.53,19.68 177.69,17.53 177.69,16.76 U$2.VIN | v155.72,53.21 v153.43,55.5 | v136.29,5.97 C8.1 | C8.1
+12V  (via drill 0.3)
  Top 0.127: IC1.1 120.92,10.16 120.92,11.43 C4.1 | v178.96,57.91 178.96,16.26 166.26,3.56 138.45,3.56 138.19,3.3 | R9.1 138.19,3.3 | C2.1 137.3,7.62 135.78,6.1 135.78,5.71 138.19,3.3
  Bottom 0.127: C6.1 131.08,6.73 130.57,7.24 130.57,7.62 D15.C 128.92,7.62 126.38,5.08 IC1.1 | C16.1 179.34,58.29 v178.96,57.91 178.83,57.78 IC3.8 | C6.1 132.48,4.7 134.64,2.54 R9.1 | C6.1
-10V  (via drill 0.3)
  Top 0.127: v16.78,47.24 37.23,47.24 v39.89,49.91 | v130.57,24.13 125.36,24.13 123.08,26.42 114.95,26.42 107.71,19.18 86.76,19.18 | IC9.3 86.76,19.18 | v57.93,47.24 75.71,29.46 77.61,29.46 86.76,20.32 86.76,19.18
  Bottom 0.127: R37.2 20.59,39.24 16.14,43.69 16.14,46.61 v16.78,47.24 17.29,47.75 17.29,48.26 R41.2 | 40.91,50.42 55.13,50.42 57.29,48.26 R29.2 57.93,48.26 v57.93,47.24 | v39.89,49.91 40.4,50.42 40.91,50.42 | 40.91,50.42 R33.2 | C14.1 80.28,16.64 81.55,17.91 81.8,17.91 82.44,18.54 82.44,18.8 | 82.44,19.05 82.44,18.8 | 80.28,22.1 77.74,22.1 R21.2 | 80.28,22.1 82.82,22.1 R12.2 82.82,21.46 82.44,21.08 82.44,19.05 | 80.28,22.1 R15.2 | 82.44,19.05 R5.2 82.44,18.8 | v130.57,24.13 R23.2 | 82.44,18.8 83.58,18.8 84.34,18.03 84.6,18.03 84.85,17.78 IC9.3
-12V  (via drill 0.3)
  Top 0.127: v82.69,10.03 86,10.03 88.28,7.75 88.28,7.11 88.79,6.6 89.81,6.6 90.57,7.37 90.57,8.13 91.08,8.64 92.09,8.64 92.85,7.87 92.85,7.24 93.49,6.6 102.76,6.6 108.6,12.45 126,12.45 126.89,11.56 133.87,11.56 134.89,12.57 C3.2
  Bottom 0.127: IC3.4 170.32,61.59 170.2,61.72 169.18,61.72 C28.2 167.4,61.85 163.34,57.78 163.34,44.58 162.58,43.81 162.58,28.57 161.94,27.94 161.69,27.94 161.56,28.07 160.67,28.07 160.54,27.94 160.04,27.94 145.94,13.84 144.8,13.84 144.16,13.21 144.16,12.7 | C5.2 132.48,15.24 134.89,12.83 | 134.89,12.83 C3.2 134.89,12.7 | v82.69,10.03 79.01,13.72 79.01,16.64 80.66,18.29 80.66,19.05 R5.1 | 144.16,12.7 136.16,12.7 136.03,12.83 134.89,12.83 | 144.16,12.7 R7.1
A0
  Top 0.127: T4.1.14/A0 152.92,51.44 152.92,54.36 154.07,55.5 154.07,63.25 151.4,65.91 151.4,71.12 146.45,76.07 139.97,76.07 139.21,75.31 136.16,75.31 130.19,81.28 128.16,81.28 112.67,96.77 104.41,96.77 98.44,102.74 92.6,102.74 90.06,100.2 17.41,100.2 16.27,99.06 FC1.P$2
A1  (via drill 0.3)
  Top 0.127: v109.87,47.62 120.67,47.62 121.94,48.9 143.91,48.9 145.81,46.99 T4.1.15/A1
  Bottom 0.127: 86.63,29.08 R13.2 86.63,28.83 | 86.63,29.08 86.63,29.34 87.01,29.72 87.01,30.48 C10.1 87.14,30.48 87.65,30.99 87.65,31.11 88.03,31.5 88.41,31.5 88.66,31.24 89.42,31.24 89.68,30.99 93.23,30.99 v109.87,47.62 | 86.63,29.08 85.23,29.08 84.09,30.23 IC2.1
A2  (via drill 0.3)
  Top 0.127: v76.47,37.08 92.47,53.09 92.47,62.87 97.04,67.44 138.95,67.44 142.26,64.14 142.26,62.74 144.8,60.2 144.8,50.67 T4.1.16/A2
  Bottom 0.127: C12.1 73.93,37.34 74.69,37.34 75.96,38.61 76.47,38.61 R14.2 v76.47,37.08 IC2.8
A3  (via drill 0.3)
  Top 0.127: v77.74,26.8 77.74,27.81 v76.6,28.96 | T4.1.17/A3 145.94,51.18 147.08,50.04 147.08,49.02 146.45,48.39 144.8,48.39 142.89,50.29 v97.81,50.29 | v92.22,44.7 91.71,44.7 88.79,41.78 87.39,41.78 77.99,32.38 77.11,32.38 v76.6,31.88
  Bottom 0.127: 76.22,30.99 73.93,30.99 C13.1 | 76.22,30.99 76.47,30.73 IC2.7 | v77.74,26.8 77.74,25.78 R20.2 | v76.6,28.96 76.47,29.08 IC2.7 | v92.22,44.7 v97.81,50.29 | v76.6,31.88 76.47,31.75 76.47,31.24 76.22,30.99 | 76.22,30.99 IC2.7
A4
  Top 0.127: T4.1.18/A4/SDA 145.94,55.5 147.34,56.9 147.34,62.48 146.19,63.63 145.05,63.63 132.35,76.33 124.35,76.33 108.86,91.82 105.43,91.82 98.69,98.55 98.69,100.08 98.57,100.2 90.82,100.2 77.11,86.49 22.75,86.49 16.27,80.01 FF1.P$2
A5
  Top 0.127: T4.1.19/A5/SCL 145.94,58.04 147.08,59.18 147.08,60.2 146.19,61.09 145.43,61.09 142.76,63.75 142.76,65.53 138.32,69.98 128.92,69.98 127.02,71.88 100.35,71.88 89.93,82.3 79.52,82.3 78.12,83.69 72.28,83.69 70.88,82.3 68.09,82.3 66.69,83.69 51.96,83.69 48.28,80.01 FF2.P$2
A6
  Top 0.127: T4.1.20/A6 145.94,59.94 142.51,63.37 142.51,65.41 138.19,69.72 127.4,69.72 126.51,70.61 77.99,70.61 66.44,82.17 59.07,82.17 56.91,80.01 FF3.P$2
A7  (via drill 0.3)
  Top 0.127: v127.4,70.87 100.98,70.87 91.84,80.01 FF4.P$2
  Bottom 0.127: T4.1.21/A7 145.18,62.23 144.41,61.47 136.79,61.47 v127.4,70.87
A8  (via drill 0.3)
  Top 0.127: v142.38,61.98 142.38,58.93 139.21,55.75 124.22,55.75 121.68,53.21 v94.89,53.21 | v92.22,50.55 90.57,50.55 76.34,36.32 v74.06,36.32 | v53.36,15.62 44.21,15.62 37.35,8.76 17.41,8.76 16.27,7.62 ENV1.P$2
  Bottom 0.127: T4.1.22/A8 145.18,64.77 v142.38,61.98 | v92.22,50.55 v94.89,53.21 | v53.36,15.62 v74.06,36.32
A9  (via drill 0.3)
  Top 0.127: v139.08,68.2 96.16,68.2 82.19,54.23 v77.11,54.23
  Bottom 0.127: 21.86,51.69 21.1,51.69 19.57,53.21 17.8,53.21 17.16,52.58 17.16,52.07 R40.2 | IC4.14 34.69,39.37 31.38,42.67 | 31.38,42.67 22.37,51.69 21.86,51.69 | 21.86,51.69 C18.1 | T4.1.23/A9 145.18,67.31 144.29,68.2 v139.08,68.2 | v77.11,54.23 76.34,53.47 42.18,53.47 31.38,42.67
A10  (via drill 0.3)
  Top 0.127: v145.18,14.35 143.27,14.35 129.81,0.89 58.44,0.89 51.83,7.49 51.83,13.46 v50.18,15.11
  Bottom 0.127: 33.29,32.26 29.48,32.26 C17.1 | 36.97,31.75 34.31,31.75 33.8,32.26 33.29,32.26 | 33.29,32.26 R36.2 | T4.1.24 160.67,36.32 160.67,36.2 160.29,35.81 160.29,35.43 160.04,35.18 160.04,33.4 157.37,30.73 157.37,29.72 157.24,29.59 157.24,28.7 157.37,28.57 157.37,26.29 146.45,15.37 146.19,15.37 v145.18,14.35 | v50.18,15.11 37.48,27.81 37.48,31.24 36.97,31.75 | 36.97,31.75 IC4.8
A11  (via drill 0.3)
  Top 0.127: v146.32,14.86 143.4,14.86 129.68,1.14 58.56,1.14 53.86,5.84 53.86,15.75 48.91,20.7 47.51,20.7 47.26,20.95 47.26,22.86 v43.7,26.42
  Bottom 0.127: C15.1 37.48,43.18 R32.2 37.61,43.18 37.73,43.05 37.73,40.89 40.78,37.85 | IC4.1 43.58,39.37 43.83,39.12 43.83,37.97 43.2,37.34 41.29,37.34 40.78,37.85 | T4.1.25 160.67,33.78 160.67,33.66 159.78,32.77 159.78,30.1 159.91,29.97 159.91,29.72 159.78,29.59 159.78,28.7 159.91,28.57 159.91,28.45 v146.32,14.86 | v43.7,26.42 43.7,28.07 40.53,31.24 40.53,37.59 40.78,37.85
A12  (via drill 0.3)
  Top 0.127: T4.1.26 161.18,32.64 154.7,39.12 v154.7,40.26 | v144.54,49.28 144.29,49.28 140.86,52.7 v96.03,52.7 | v91.96,53.72 76.6,53.72 v67.33,44.45
  Bottom 0.127: C1.1 62.5,50.93 60.21,53.21 58.44,53.21 57.8,52.58 57.8,52.07 R27.2 | IC4.7 51.58,31.75 58.56,38.73 58.56,40.13 63.52,45.09 | 63.52,45.09 63.52,49.91 63.01,50.42 C1.1 | C1.1 | v154.7,40.26 146.7,48.26 146.45,48.26 146.32,48.39 145.43,48.39 145.3,48.26 145.18,48.26 144.54,48.9 v144.54,49.28 | v96.03,52.7 95.01,53.72 v91.96,53.72 | v67.33,44.45 66.69,45.09 63.52,45.09
A13  (via drill 0.3)
  Top 0.127: T4.1.27 161.18,28.7 163.21,26.67 163.21,22.23 v163.47,21.97 | v159.78,16.76 159.53,16.76 151.4,8.64 137.94,8.64 129.94,0.64 43.58,0.64 36.59,7.62 ENV2.P$2
  Bottom 0.127: v163.47,21.97 162.45,20.95 162.45,20.83 161.94,20.32 161.69,20.32 161.56,20.45 160.67,20.45 160.54,20.32 160.42,20.32 159.78,19.68 v159.78,16.76
A14  (via drill 0.3)
  Top 0.127: T4.1.38 144.16,29.21 130.83,15.88 107.97,15.88 v102.5,10.41 | v101.87,11.05 80.28,11.05 77.99,8.76 58.05,8.76 56.91,7.62 ENV3.P$2
  Bottom 0.127: v101.87,11.05 v102.5,10.41
A15
  Top 0.127: T4.1.39 135.91,21.72 113.17,21.72 102,10.54 80.15,10.54 77.23,7.62 ENV4.P$2
A16  (via drill 0.3)
  Top 0.127: T4.1.40 145.94,35.18 142.13,38.99 v142.13,48.39 | v122.83,72.39 122.57,72.39 98.69,96.27 98.69,97.92 97.55,99.06 FEEDBACK.P$2
  Bottom 0.127: v142.13,48.39 142.13,48.77 130.7,60.2 130.7,64.52 v122.83,72.39
A17  (via drill 0.3)
  Top 0.127: T4.1.41 145.94,35.94 147.08,34.8 147.08,33.78 146.19,32.89 145.43,32.89 143.27,30.73 143.27,29.46 142.89,29.08 133.11,29.08 129.68,32.51 91.58,32.51 v91.33,32.26
  Bottom 0.127: 86.63,33.91 C9.2 | 86.63,33.91 85.61,33.91 84.09,35.43 IC2.14 | 86.63,33.91 R24.2 | v91.33,32.26 89.68,33.91 C9.2 | C9.2
D0  (via drill 0.3)
  Top 0.127: v153.05,58.67 153.05,56.39 147.34,50.67 147.34,46.74 146.45,45.85 145.3,45.85 144.54,45.09 144.54,39.12 145.69,37.97 146.45,37.97 147.34,37.08 147.34,31.5 146.19,30.35 144.92,30.35 134,19.43 QUANTISE.1
  Bottom 0.127: T4.1.0/RX 160.42,72.39 158,69.98 157.5,69.98 153.81,66.29 153.81,59.44 v153.05,58.67
D1  (via drill 0.3)
  Top 0.127: T1.3 105.43,17.78 106.57,18.92 108.73,18.92 v115.71,25.91
  Bottom 0.127: v115.71,25.91 127.65,37.85 132.22,37.85 145.18,50.8 145.43,50.8 145.56,50.93 146.45,50.93 146.57,50.8 146.7,50.8 156.61,60.71 156.61,66.55 157.37,67.31 157.62,67.31 157.75,67.44 158.51,67.44 158.64,67.31 158.89,67.31 161.18,69.6 T4.1.1/TX
D2
  Top 0.127: T4.1.2 157.88,67.31 156.99,66.42 156.99,63.12 157.75,62.36 159.66,62.36 160.67,63.37 161.69,63.37 162.32,62.74 162.32,61.72 161.43,60.83 160.67,60.83 159.27,59.44 159.27,57.4 154.19,52.32 154.19,35.69 160.04,29.84 160.04,28.7 160.93,27.81 161.69,27.81 162.96,26.54 162.96,21.84 166.89,17.91 168.93,17.91 170.07,16.76 U$2.DIN
D3  (via drill 0.3)
  Top 0.127: v155.72,52.58 155.72,50.8 160.67,45.85 161.43,45.85 162.32,44.96 162.32,28.7 163.85,27.18 164.48,27.18 172.61,19.05 172.61,16.76 U$2.LCK
  Bottom 0.127: v155.72,52.58 159.78,56.64 159.78,62.99 161.18,64.39 T4.1.3
D4  (via drill 0.3)
  Top 0.127: T4.1.4 158.51,59.56 157.75,59.56 155.46,57.28 v155.46,55.37 | v154.83,54.74 154.83,54.23 153.94,53.34 153.94,35.56 159.78,29.72 159.78,26.42 160.93,25.27 161.69,25.27 162.7,24.26 162.7,21.59 167.53,16.76 U$2.BCK
  Bottom 0.127: v154.83,54.74 v155.46,55.37
D5
  Top 0.127: ALGORITHM.10 162.83,78.49 173.75,67.56 173.75,66.67 166.77,59.69 T4.1.5
D6
  Top 0.127: T4.1.6 166.77,57.15 176.29,66.67 176.29,67.56 167.15,76.71 167.15,87.12 ALGORITHM.9
D7
  Top 0.127: T4.1.7 160.04,55.75 160.04,57.66 160.67,58.29 165.75,58.29 174.01,66.55 174.01,67.69 166.13,75.56 166.13,87.5 167.02,88.39 167.91,88.39 ALGORITHM.8
D8
  Top 0.127: T4.1.8 164.23,52.07 176.55,64.39 176.55,67.69 168.93,75.31 168.93,91.44 ALGORITHM.7
D9
  Top 0.127: T4.1.9 162.07,49.53 177.31,64.77 177.31,67.56 172.23,72.64 172.23,92.08 158.77,105.54 108.6,105.54 106.95,103.89 FB2/4.1
D10  (via drill 0.3)
  Top 0.127: v154.45,53.21 155.34,54.1 155.34,54.86 154.57,55.63 154.57,63.5 152.29,65.79 152.29,76.45 167.02,91.19 167.02,95.63 ALGORITHM.6
  Bottom 0.127: v154.45,53.21 160.16,47.5 160.29,47.5 160.8,46.99 T4.1.10/CS
D11
  Bottom 0.127: T4.1.11/MOSI 161.18,44.58 163.08,46.48 163.08,57.91 166.89,61.72 166.89,67.94 166.77,68.07 167.66,68.96 167.66,70.99 165.75,72.9 165.75,96.52 ALGORITHM.5
D12  (via drill 0.3)
  Top 0.127: v155.08,57.78 155.08,63.37 152.54,65.91 152.54,76.33 167.91,91.69 167.91,96.01 166.39,97.54 162.83,97.54 ALGORITHM.4
  Bottom 0.127: v155.08,57.78 152.92,55.63 152.92,50.55 161.18,42.29 T4.1.12/MISO
D13
  Top 0.127: T4.1.13/SCK 149.62,41.91 153.18,45.47 153.18,53.09 154.32,54.23 154.32,63.37 152.03,65.66 152.03,81.92 158.51,88.39 158.51,95.63 ALGORITHM.3
D28  (via drill 0.3)
  Top 0.127: v162.58,46.61 162.58,29.46 v163.08,28.96
  Bottom 0.127: v162.58,46.61 162.58,70.48 162.7,70.61 162.7,75.56 161.69,76.58 161.69,90.55 158.13,94.11 158,94.11 157.75,94.36 ALGORITHM.2 | v163.08,28.96 162.83,28.7 162.83,28.45 161.18,26.8 T4.1.28
D29
  Top 0.127: ENV_MODE.4 89.68,7.62 91.2,9.14 103.52,9.14 108.22,13.84 108.22,14.61 109.24,15.62 138.32,15.62 145.69,22.99 160.04,22.99 T4.1.29
D30
  Top 0.127: ENV_MODE.2 94.76,7.62 96.03,8.89 104.66,8.89 108.6,12.83 125.87,12.83 127.52,14.48 139.72,14.48 145.69,20.45 160.04,20.45 T4.1.30
D31
  Bottom 0.127: T4.1.31/A12 161.69,18.54 161.69,18.41 162.07,18.03 162.07,17.78 169.94,9.91 176.55,9.91 178.07,8.38 178.96,8.38 RESET.1
D32
  Top 0.127: ENV_MODE.3 92.09,7.62 98.31,1.4 129.56,1.4 143.53,15.37 157.75,15.37 159.66,17.27 160.42,17.27 T4.1.32
D33
  Top 0.127: T4.1.33 158.51,16.51 159.66,17.65 164.1,17.65 164.99,16.76 U$2.SCK
D34  (via drill 0.3)
  Top 0.127: v93.23,57.02 93.23,54.23 99.08,48.39 108.47,48.39 123.21,33.66 134.51,33.66 v138.06,30.1
  Bottom 0.127: v93.23,57.02 90.06,60.2 77.74,60.2 R4.2 | v138.06,30.1 138.06,27.3 145.94,19.43 T4.1.34
D35  (via drill 0.3)
  Top 0.127: v59.07,59.05 59.07,50.67 73.93,35.81 81.04,35.81 88.15,42.93 v89.3,42.93 | v93.23,38.99 95.65,38.99 101.87,32.77 131.72,32.77 133.11,31.37 v135.53,31.37
  Bottom 0.127: v59.07,59.05 58.05,60.07 57.42,60.07 R3.2 | v93.23,38.99 v89.3,42.93 | v135.53,31.37 137.43,31.37 144.54,24.26 144.54,23.37 145.94,21.97 T4.1.35
D36  (via drill 0.3)
  Top 0.127: v40.91,55.75 40.91,50.29 44.72,46.48 44.72,45.59 51.45,38.86 v65.04,38.86 | v66.94,38.86 68.6,38.86 79.77,27.69 117.87,27.69 121.3,31.11 124.48,31.11 127.27,28.32 v141.88,28.32
  Bottom 0.127: R2.2 37.1,59.56 v40.91,55.75 | v66.94,38.86 v65.04,38.86 | v141.88,28.32 145.94,24.26 T4.1.36
D37  (via drill 0.3)
  Top 0.127: v59.58,53.98 59.58,50.55 70.25,39.88 78.63,39.88 v91.84,53.09 | v93.23,53.09 94,53.09 98.95,48.13 108.35,48.13 123.08,33.4 134.13,33.4 137.94,29.59 v142.76,29.59
  Bottom 0.127: v59.58,53.98 41.42,53.98 35.2,60.2 16.78,60.2 R1.2 | v93.23,53.09 v91.84,53.09 | v142.76,29.59 145.69,26.67 T4.1.37
D+
  Top 0.127: USBHOST.3 172.61,67.06 172.1,67.06 168.67,63.63 158.38,63.63 158.26,63.5 T4.1.UD+
D-
  Top 0.127: T4.1.UD- 169.05,66.04 170.07,67.06 170.7,67.06 USBHOST.2
GND
  pour Bottom: 0.27,105.41 180.74,105.79 180.61,0 0.27,0
N$1
  Bottom 0.127: IC3.1 171.47,57.78 170.07,56.39 169.18,56.39 C11.2 169.18,55.75 168.8,55.37 168.8,53.34 R62.2
N$2
  Bottom 0.127: R3.1 57.42,61.85 53.61,61.85 LEVEL3.P$B
N$3
  Bottom 0.127: 39.26,46.99 39.77,46.99 40.27,47.5 | 40.27,47.5 40.91,48.13 R33.1 | 39.26,46.99 39.26,43.18 | 39.26,46.99 C15.2 | 42.56,45.72 42.05,45.72 40.27,47.5 | R35.2 43.45,44.32 42.56,45.21 42.56,45.72 | 42.56,45.72 R34.2 | IC4.2 40.91,38.1 39.51,39.5 39.51,42.93 39.26,43.18 | 39.26,43.18 R32.1
N$4
  Top 0.127: J1.1 J1.2
  Bottom 0.127: J1.1 156.23,8.89 154.83,10.29 D1.C
N$5
  Bottom 0.127: V/OCT_IN.P$1 106.95,29.84 104.92,31.88 104.92,33.02 R25.1
N$6
  Top 0.127: J1.10 J1.9
  Bottom 0.127: D3.A 154.96,6.35 156.61,4.7 165.24,4.7 166.89,6.35 J1.10
N$7
  Bottom 0.127: R9.2 146.45,3.68 D3.C
N$8  (via drill 0.3)
  Top 0.127: v44.21,39.75 44.21,29.21 47.26,26.16 v47.26,23.88
  Bottom 0.127: R35.1 43.45,40.51 v44.21,39.75 | v47.26,23.88 46.12,22.73 46.12,21.97 LEVEL3.P$2
N$9
  Bottom 0.127: D1.A 146.07,12.57 145.94,12.7 R7.2
N$10
  Bottom 0.127: R4.1 77.74,61.85 73.93,61.85 LEVEL4.P$B
N$11
  Bottom 0.127: R10.2 167.15,49.53 167.15,47.24 164.35,44.45 164.35,43.56 U$2.L
N$12
  Bottom 0.127: 170.45,29.72 174.64,29.72 175.02,30.1 175.53,30.1 R6.1 | 170.45,29.72 166.13,29.72 164.74,28.32 164.35,28.32 U$2.3 | 170.45,29.72 R8.2
N$13
  Bottom 0.127: R53.2 173.88,53.34 173.88,48.39 164.35,38.86 164.35,38.48 U$2.R
N$14
  Top 0.127: ATT2.P$3 97.55,63.5 103.78,63.5 106.19,65.91 106.95,65.91 F3MOD.P$1
N$15  (via drill 0.3)
  Top 0.127: v79.01,34.04 75.33,34.04 58.56,50.8 58.56,71.88 v58.82,72.14
  Bottom 0.127: v79.01,34.04 79.14,33.91 80.53,33.91 82.57,31.88 82.06,31.37 82.06,29.46 82.44,29.08 82.44,28.96 82.06,28.57 82.06,26.67 R26.1 | v58.82,72.14 37.99,92.96 37.99,98.17 37.1,99.06 FC2.P$2
N$16  (via drill 0.3)
  Top 0.127: v94.25,64.01 94.25,62.87 92.73,61.34 92.73,34.29 88.79,30.35 v88.79,29.46
  Bottom 0.127: R12.1 82.82,25.27 83.71,26.16 83.71,26.67 | IC2.2 82.82,28.07 83.71,27.18 83.71,26.92 | 83.71,26.67 83.71,26.92 | 83.71,26.67 R26.2 83.71,26.92 | 86.63,27.05 87.14,27.05 88.79,28.7 v88.79,29.46 C10.2 | v94.25,64.01 R11.2 | 83.71,26.92 86.5,26.92 86.63,27.05 | 86.63,27.05 R13.1
N$17
  Bottom 0.127: R15.1 80.28,24.89 80.92,25.53 80.92,28.7 80.66,28.96 80.66,29.08 81.04,29.46 81.04,31.37 78.5,33.91 78.12,33.91 77.74,34.29 IC2.9 77.74,36.96 77.99,37.21 78.25,37.21 79.01,37.97 R18.2 79.01,38.61 78.38,38.61 77.61,39.37 77.61,39.62 77.11,40.13 76.98,40.13 | C12.2 74.69,38.99 75.96,40.26 76.47,40.26 R14.1 | R19.2 94.25,57.15 78.38,41.27 78.12,41.27 76.98,40.13 | 76.98,40.13 76.47,40.13 R14.1 | 76.98,40.13 R14.1
N$18
  Bottom 0.127: R11.1 94.25,79.63 97.04,79.63 97.42,80.01 ATT1.P$2
N$19  (via drill 0.3)
  Top 0.127: v92.22,41.53 87.52,41.53 v77.87,31.88
  Bottom 0.127: 77.74,23.75 78.38,23.75 79.14,24.51 79.14,25.65 79.26,25.78 R20.1 | 77.74,31.75 76.85,32.64 73.93,32.64 C13.2 | 77.74,31.75 IC2.6 77.74,29.46 76.22,27.94 | 76.22,27.94 75.83,27.56 75.2,27.56 R17.2 | v92.22,41.53 94.25,41.53 R22.2 | 77.74,31.75 v77.87,31.88 | 77.74,23.75 77.11,23.75 76.34,24.51 76.34,27.81 76.22,27.94 | 77.74,23.75 R21.1
N$20
  Bottom 0.127: R19.1 94.25,60.58 97.04,60.58 97.42,60.96 ATT2.P$2
N$21  (via drill 0.3)
  Top 0.127: R16.S 126.13,29.84 123.97,32 v106.57,32 106.06,31.5 v90.57,31.5
  Bottom 0.127: 86.63,32.26 89.17,32.26 C9.1 89.17,32.13 89.93,32.13 v90.57,31.5 | 86.63,32.26 84.85,32.26 82.82,34.29 IC2.13 | 86.63,32.26 R24.1 | v106.57,32 106.57,33.02 R25.2
N$22  (via drill 0.3)
  Top 0.127: v74.18,26.29 74.18,30.35 57.42,47.12 57.42,57.28 58.31,58.17 58.31,76.2 v62.88,80.77
  Bottom 0.127: v74.18,26.29 74.56,25.91 75.2,25.91 R17.1 | v62.88,80.77 75.71,93.6 75.71,98.17 76.6,99.06 FC4.P$2
N$23
  Top 0.127: ATT3.P$3 97.55,44.45 103.78,44.45 106.19,46.86 106.95,46.86 F4MOD.P$1
N$24  (via drill 0.3)
  Top 0.127: v77.99,40.39 70.12,40.39 63.39,47.12 63.39,81.41 v63.14,81.66
  Bottom 0.127: v77.99,40.39 78.12,40.26 79.01,40.26 R18.1 | v63.14,81.66 63.14,93.34 57.42,99.06 FC3.P$2
N$25
  Bottom 0.127: R16.E 133.49,26.29 133.24,26.04 133.24,24.13 R23.1
N$26
  Bottom 0.127: IC3.7 176.93,59.05 176.93,60.33 IC3.6
N$27
  Bottom 0.127: ATT3.P$2 96.92,41.91 94.89,39.88 94.25,39.88 R22.1
N$28
  Top 0.127: ATT1.P$3 97.55,82.55 103.78,82.55 106.19,84.96 106.95,84.96 F2MOD.P$1
N$29
  Bottom 0.127: R28.2 96.79,27.56 92.22,27.56 90.69,29.08 90.44,29.08 GATE_IN.P$1
N$30
  Bottom 0.127: 96.79,22.23 R28.1 | 96.79,22.23 97.93,22.23 102.5,17.65 T1.2 | 96.79,22.23 D2.C
N$31
  Bottom 0.127: 60.85,48.77 60.59,48.77 60.09,48.26 59.58,48.26 | 60.85,48.77 62.5,48.77 C1.2 | 60.85,48.77 59.58,50.04 59.58,52.07 R27.1 | IC4.6 50.94,33.02 57.29,39.37 R31.2 57.93,39.37 57.93,43.56 58.31,43.94 58.31,44.45 R30.2 58.18,44.45 58.18,44.96 59.58,46.35 59.58,48.26 | 59.58,48.26 R29.1
N$32  (via drill 0.3)
  Top 0.127: v59.58,38.35 59.58,28.7 66.31,21.97 LEVEL4.P$2
  Bottom 0.127: v59.58,38.35 59.58,39.37 R31.1
N$33
  Top 0.127: L4ATT.P$3 129.3,44.45 135.53,44.45 137.94,46.86 138.7,46.86 L4MOD.P$1
N$34  (via drill 0.3)
  Top 0.127: v58.69,47.12 60.72,47.12 79.9,27.94 115.84,27.94 v119.4,31.5
  Bottom 0.127: v58.69,47.12 56.66,45.09 56.66,44.45 R30.1 | v119.4,31.5 127.52,39.62 127.52,40.77 128.67,41.91 L4ATT.P$2
N$36
  Top 0.127: L3ATT.P$3 129.3,63.5 135.53,63.5 137.94,65.91 138.7,65.91 L3MOD.P$1
N$37  (via drill 0.3)
  Top 0.127: v57.8,58.29 v45.23,45.72 | v94.5,62.1 100.09,62.1 105.93,56.26 119.02,56.26 123.71,60.96 L3ATT.P$2
  Bottom 0.127: v45.23,45.72 R34.1 | v57.8,58.29 62.5,58.29 67.71,63.5 89.04,63.5 90.44,62.1 v94.5,62.1
N$39
  Bottom 0.127: R2.1 37.1,61.85 33.29,61.85 LEVEL2.P$B
N$40
  Bottom 0.127: R37.1 20.59,30.1 | 21.86,29.34 R39.2 | 21.86,29.34 21.1,30.1 20.59,30.1 | 20.59,30.1 R38.2 | 33.29,33.91 C17.2 | IC4.9 34.69,33.02 33.8,33.91 33.29,33.91 | 33.29,33.91 R36.1 | 21.86,29.34 24.4,29.34 28.97,33.91 C17.2 | C17.2
N$41
  Bottom 0.127: R39.1 21.86,23.37 23.64,23.37 25.04,21.97 25.67,21.97 LEVEL2.P$2
N$42
  Top 0.127: L2ATT.P$3 129.3,82.55 135.53,82.55 137.94,84.96 138.7,84.96 L2MOD.P$1
N$43  (via drill 0.3)
  Top 0.127: v20.97,27.43 42.43,27.43 v43.7,28.7 | v66.56,44.58 66.82,44.58 91.58,69.34 126.13,69.34 v126.64,69.85
  Bottom 0.127: R38.1 20.59,27.81 v20.97,27.43 | v43.7,28.7 50.69,28.7 v66.56,44.58 | v126.64,69.85 126.64,77.98 128.67,80.01 L2ATT.P$2
N$45
  Bottom 0.127: R1.1 16.78,61.85 12.97,61.85 LEVEL1.P$B
N$46
  Bottom 0.127: 20.72,49.53 19.45,48.26 18.94,48.26 | 20.72,49.53 21.1,49.91 C18.2 | 20.72,49.53 18.94,51.31 18.94,52.07 R40.1 | 18.94,44.45 20.46,44.45 21.35,43.56 21.86,43.56 R42.2 21.86,43.69 22.37,43.69 27.96,38.1 IC4.13 | 18.94,44.45 18.94,48.26 | 18.94,48.26 R41.1 | 18.94,44.45 R43.2
N$47  (via drill 0.3)
  Top 0.127: v17.16,43.43 17.16,33.66 5.48,21.97 LEVEL1.P$2
  Bottom 0.127: v17.16,43.43 17.16,44.45 R43.1
N$48
  Top 0.127: L1ATT.P$3 129.3,101.6 135.53,101.6 137.94,104.01 138.7,104.01 L1MOD.P$1
N$49  (via drill 0.3)
  Top 0.127: v21.86,47.75 21.86,69.6 14.75,76.71 14.75,102.36 17.92,105.54 102,105.54 106.19,101.35 126.89,101.35 129.18,99.06 L1ATT.P$2
  Bottom 0.127: v21.86,47.75 R42.1
N$53
  Bottom 0.127: R10.1 168.8,49.53 168.8,50.55 171.59,53.34 R53.1 172.23,53.34 172.23,56.26 173.24,57.28 173.24,58.8 172.99,59.05 IC3.2 170.58,59.05 169.56,58.04 169.18,58.04 | 169.18,58.04 165.37,58.04 R55.2 | 169.18,58.04 C11.1
N$55  (via drill 0.3)
  Top 0.127: v164.23,44.96 164.48,44.96 173.88,35.56 173.88,16.26 173.24,15.62 167.15,15.62 166.26,16.51 166.26,17.14 165.5,17.91 144.54,17.91 129.3,2.67 109.49,2.67 OUT.P$1
  Bottom 0.127: R55.1 165.37,55.63 167.15,53.85 167.15,53.34 | 167.15,53.34 167.15,51.44 164.48,48.77 164.48,45.21 v164.23,44.96 | 167.15,53.34 R62.1
VCC  (via drill 0.3)
  Top 0.127: 16.14,13.72 16.14,10.16 ENV1.P$3 | 16.14,13.72 8.02,21.84 LEVEL1.P$1 | 32.91,17.27 28.34,21.84 LEVEL2.P$1 28.21,21.84 20.08,13.72 16.14,13.72 | 32.91,17.27 36.47,13.72 36.47,10.16 ENV2.P$3 | v79.39,26.92 78.5,26.92 74.82,23.24 | 74.82,23.24 74.69,23.11 70.12,23.11 68.98,21.97 LEVEL4.P$1 68.85,21.84 68.47,21.84 60.34,13.72 56.78,13.72 | 74.82,23.24 77.11,20.95 77.11,10.16 ENV4.P$3 | 44.34,28.7 46.75,26.29 46.75,23.75 48.53,21.97 LEVEL3.P$1 48.66,21.84 56.78,13.72 | 44.34,28.7 43.7,29.34 v43.7,35.94 43.7,47.12 35.32,55.5 35.32,81.28 36.47,82.42 FF2.P$3 | 56.78,13.72 56.78,10.16 ENV3.P$3 | 44.34,28.7 32.91,17.27 | v153.05,69.72 158.64,69.72 159.66,68.71 161.43,68.71 162.96,67.18 168.16,67.18 USBHOST.1 | T4.1.V33 156.1,30.86 146.19,40.77 145.43,40.77 144.8,41.4 144.8,44.96 145.43,45.59 146.57,45.59 152.67,51.69 152.67,55.63 153.56,56.52 153.56,62.36 146.07,69.85 T4.1.3V3_LO 139.21,69.85 130.19,78.87 122.19,78.87 108.98,92.08 106.06,92.08 98.95,99.19 98.95,100.2 97.55,101.6 FEEDBACK.P$3 97.42,101.47 91.71,101.47 86.88,96.65 77.23,96.65 FC4.P$1 77.11,96.65 76.98,96.77 69.36,96.77 69.23,96.65 56.91,96.65 FC3.P$1 56.78,96.65 56.66,96.77 49.04,96.77 48.91,96.65 36.59,96.65 FC2.P$1 36.47,96.65 36.34,96.77 28.72,96.77 26.3,94.36 16.14,94.36 | FF3.P$3 56.91,82.42 67.58,82.42 67.96,82.04 76.72,82.04 77.11,82.42 FF4.P$3 | 16.14,94.36 16.14,82.55 FF1.P$3 | 16.14,94.36 15,95.5 15,100.33 16.14,101.47 FC1.P$3
  Bottom 0.127: IC2.4 80.28,29.08 79.9,28.7 C19.1 79.77,27.94 79.77,27.3 v79.39,26.92 | IC4.4 43.32,35.56 v43.7,35.94 44.09,36.32 44.72,36.32 C20.1 | T4.1.V33 156.1,29.97 159.78,33.66 159.78,37.59 161.18,38.99 T4.1.3V3 | v153.05,69.72 146.96,69.72 146.83,69.85 T4.1.3V3_LO | FF2.P$3 36.47,82.55 36.47,96.52 FC2.P$1 | FF3.P$3 56.78,82.55 56.78,96.52 FC3.P$1

### Text on the board
tNames: USB / (NO 5V)
bNames: USB HOST